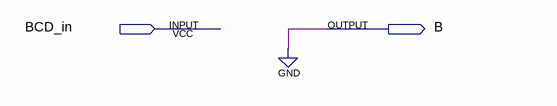
[diagram p0: schematic sheet]
// Quartus schematic DECOD_BCD_B.bdf as structural Verilog: 0 symbols, 2 pins
module DECOD_BCD_B (
  input  BCD_in,
  output B
);


  assign B = 1'b0;
endmodule
